# Altium schematic sheet GPS - NEO-M8T.SchDoc
size A4
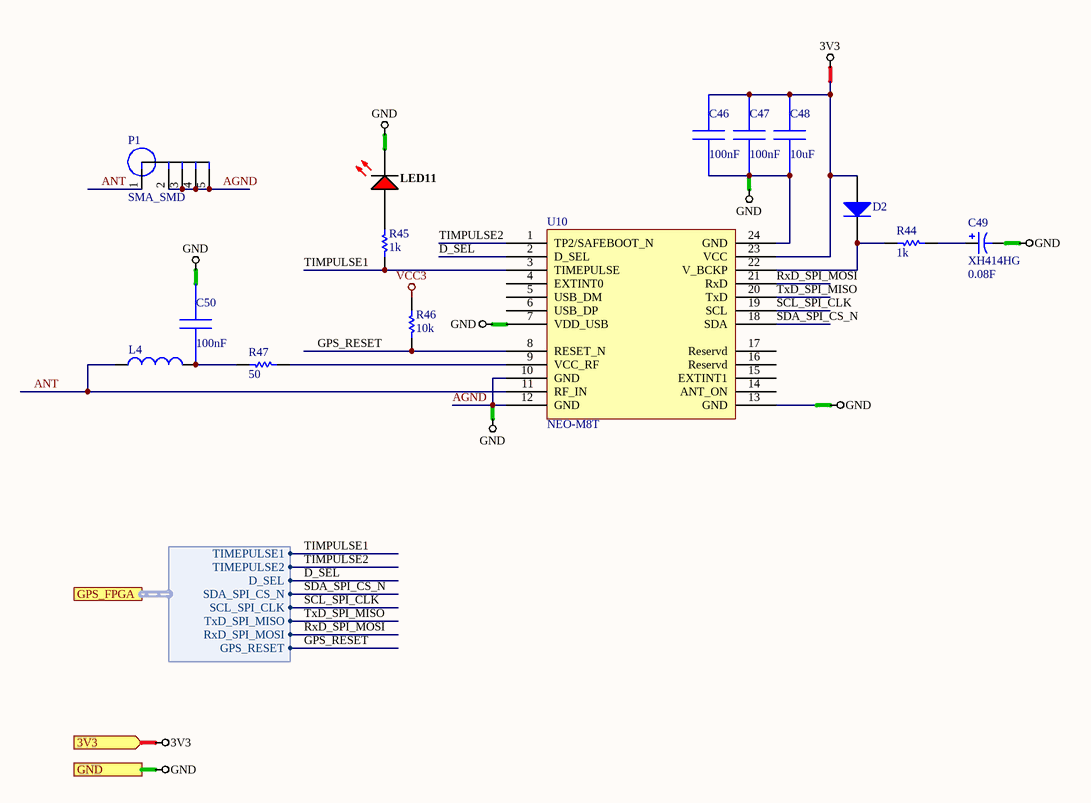
[diagram p0: GPS - NEO-M8T.SchDoc]

## Parts
C46  value 100nF  [C-0603]  (hidden comment: C0603C104K3RACTU)
C47  value 100nF  [C-0603]  (hidden comment: C0603C104K3RACTU)
C48  value 10uF  [1206]  (hidden comment: GRM31CR61E106KA12L)
C49  XH414HG  value 0.08F  [RB7.6-15]
C50  value 100nF  [C-0603]  (hidden comment: C0603C104K3RACTU)
D2  (no value)  [SMC]
L4  (no value)  [0402-A]
LED11  0402-LED-RED  [LED_0402]  (value not drawn)
P1  SMA_SMD  [SMA]
R44  1k  [RESC0402(1005)40_L]
R45  1k  [RESC0402(1005)40_L]
R46  10k  [RESC0402(1005)40_L]
R47  50  [RESC0402(1005)40_L]
U10  NEO-M8T  [NEO]

## Ports
3V3 (in), GND, GPS_FPGA (harness GPS_FPGA)

## Harnesses
GPS_FPGA: TIMEPULSE1, TIMEPULSE2, SDA_SPI_CS_N, SCL_SPI_CLK, TxD_SPI_MISO, RxD_SPI_MOSI, D_SEL, GPS_RESET

## Nets
3V3: C46.1 C47.1 C48.1 D2.1(A) U10.23(VCC) ; port 3V3
AGND: C46.2 C47.2 C48.2 C49.2 C50.1 LED11.2(K) P1.2 P1.3 P1.4 P1.5 U10.7(VDD_USB) U10.10(GND) U10.12(GND) U10.13(GND) U10.24(GND) ; port GND  [also labelled GND]
VCC3: R46.1
ANT: L4.1 P1.1 U10.11(RF_IN)
D_SEL: U10.2(D_SEL) ; port GPS_FPGA.D_SEL
GPS_RESET: R46.2 U10.8(RESET_N) ; port GPS_FPGA.GPS_RESET
RxD_SPI_MOSI: U10.21(RxD) ; port GPS_FPGA.RxD_SPI_MOSI
SCL_SPI_CLK: U10.19(SCL) ; port GPS_FPGA.SCL_SPI_CLK
SDA_SPI_CS_N: U10.18(SDA) ; port GPS_FPGA.SDA_SPI_CS_N
TIMPULSE1: R45.1 U10.3(TIMEPULSE) ; port GPS_FPGA.TIMEPULSE1
TIMPULSE2: U10.1(TP2/SAFEBOOT_N) ; port GPS_FPGA.TIMEPULSE2
TxD_SPI_MISO: U10.20(TxD) ; port GPS_FPGA.TxD_SPI_MISO
NetC49_1: C49.1 R44.2
NetC50_2: C50.2 L4.2 R47.1
NetD2_2: D2.2(K) R44.1 U10.22(V_BCKP)
NetLED11_1: LED11.1(A) R45.2
NetR47_2: R47.2 U10.9(VCC_RF)

Not connected (* = marked no-connect by the designer): U10 4(EXTINT0) 5(USB_DM) 6(USB_DP) 14(ANT_ON) 15(EXTINT1) 16(Reservd) 17(Reservd)

## Library data of the parts
C46 C47 C50 = C0603C104K3RACTU: Manufacturer Name: Kemet; PackageReference: C0603C104K3RACTU; Manufacturer Part Number: C0603C104K3RACTU
C48 = GRM31CR61E106KA12L: GRM31CR61E106KA1; Manufacturer Name: MuRata; PackageReference: GRM31CR61E106KA12L; Manufacturer Part Number: GRM31CR61E106KA12L
C49 = Cap Pol1: Polarized Capacitor (Radial); Published: 8-Jun-2000; LatestRevisionDate: 17-Jul-2002; LatestRevisionNote: Re-released for DXP Platform.; PackageReference: RB7.6-15; Publisher: Altium Limited
D2 = Diode: Default Diode; Published: 8-Jun-2000; LatestRevisionDate: 17-Jul-2002; LatestRevisionNote: Re-released for DXP Platform.; PackageDocument: Sep-1996; PackageReference: SMC; Publisher: Altium Limited; Code_JEDEC: DO-214-AB
L4 = Inductor: Code_IEC: 1005; Published: 8-Jun-2000; LatestRevisionDate: 17-Jul-2002; LatestRevisionNote: Re-released for DXP Platform.; PackageReference: 0402-A; Publisher: Altium Limited; Code_JEITA: 0402
LED11 = LED_RED_A1K2-2: 0402 LED,RED; Manufacturer_PN: LTST-C190KRKT; ID: CMP-0201-0013; DefaultDesignator: LED?; Class: Diodes; Current Average (Io): 1.8V; Sub Class: LED; Reverse Voltage DC (Vr): Red; ComponentLink1Description: Datasheet; ComponentLink1URL: http://optoelectronics.liteon.com/upload/download/DS-22-99-0151/S_110_LTST-C190KRKT.pdf; ComponentLink2Description: Manufacturer; ComponentLink2URL: http://www.liteon.com; Manufacturer Part Number: LTST-C190KRKT
R44 R45 R47 = Res Semi: Semiconductor Resistor; Manufacturer: Generic Components; Class: Passive; Value: 10k; Published: 08/06/2000; Publisher: Altium Hobart Technology Centre; SubClass: Resistor
R46 = Res Semi: Semiconductor Resistor; Manufacturer: Generic Components; Class: Passive; Published: 08/06/2000; Publisher: Altium Hobart Technology Centre; SubClass: Resistor; Value: 10k